# EAGLE schematic untitled (EAGLE 9.6.2)
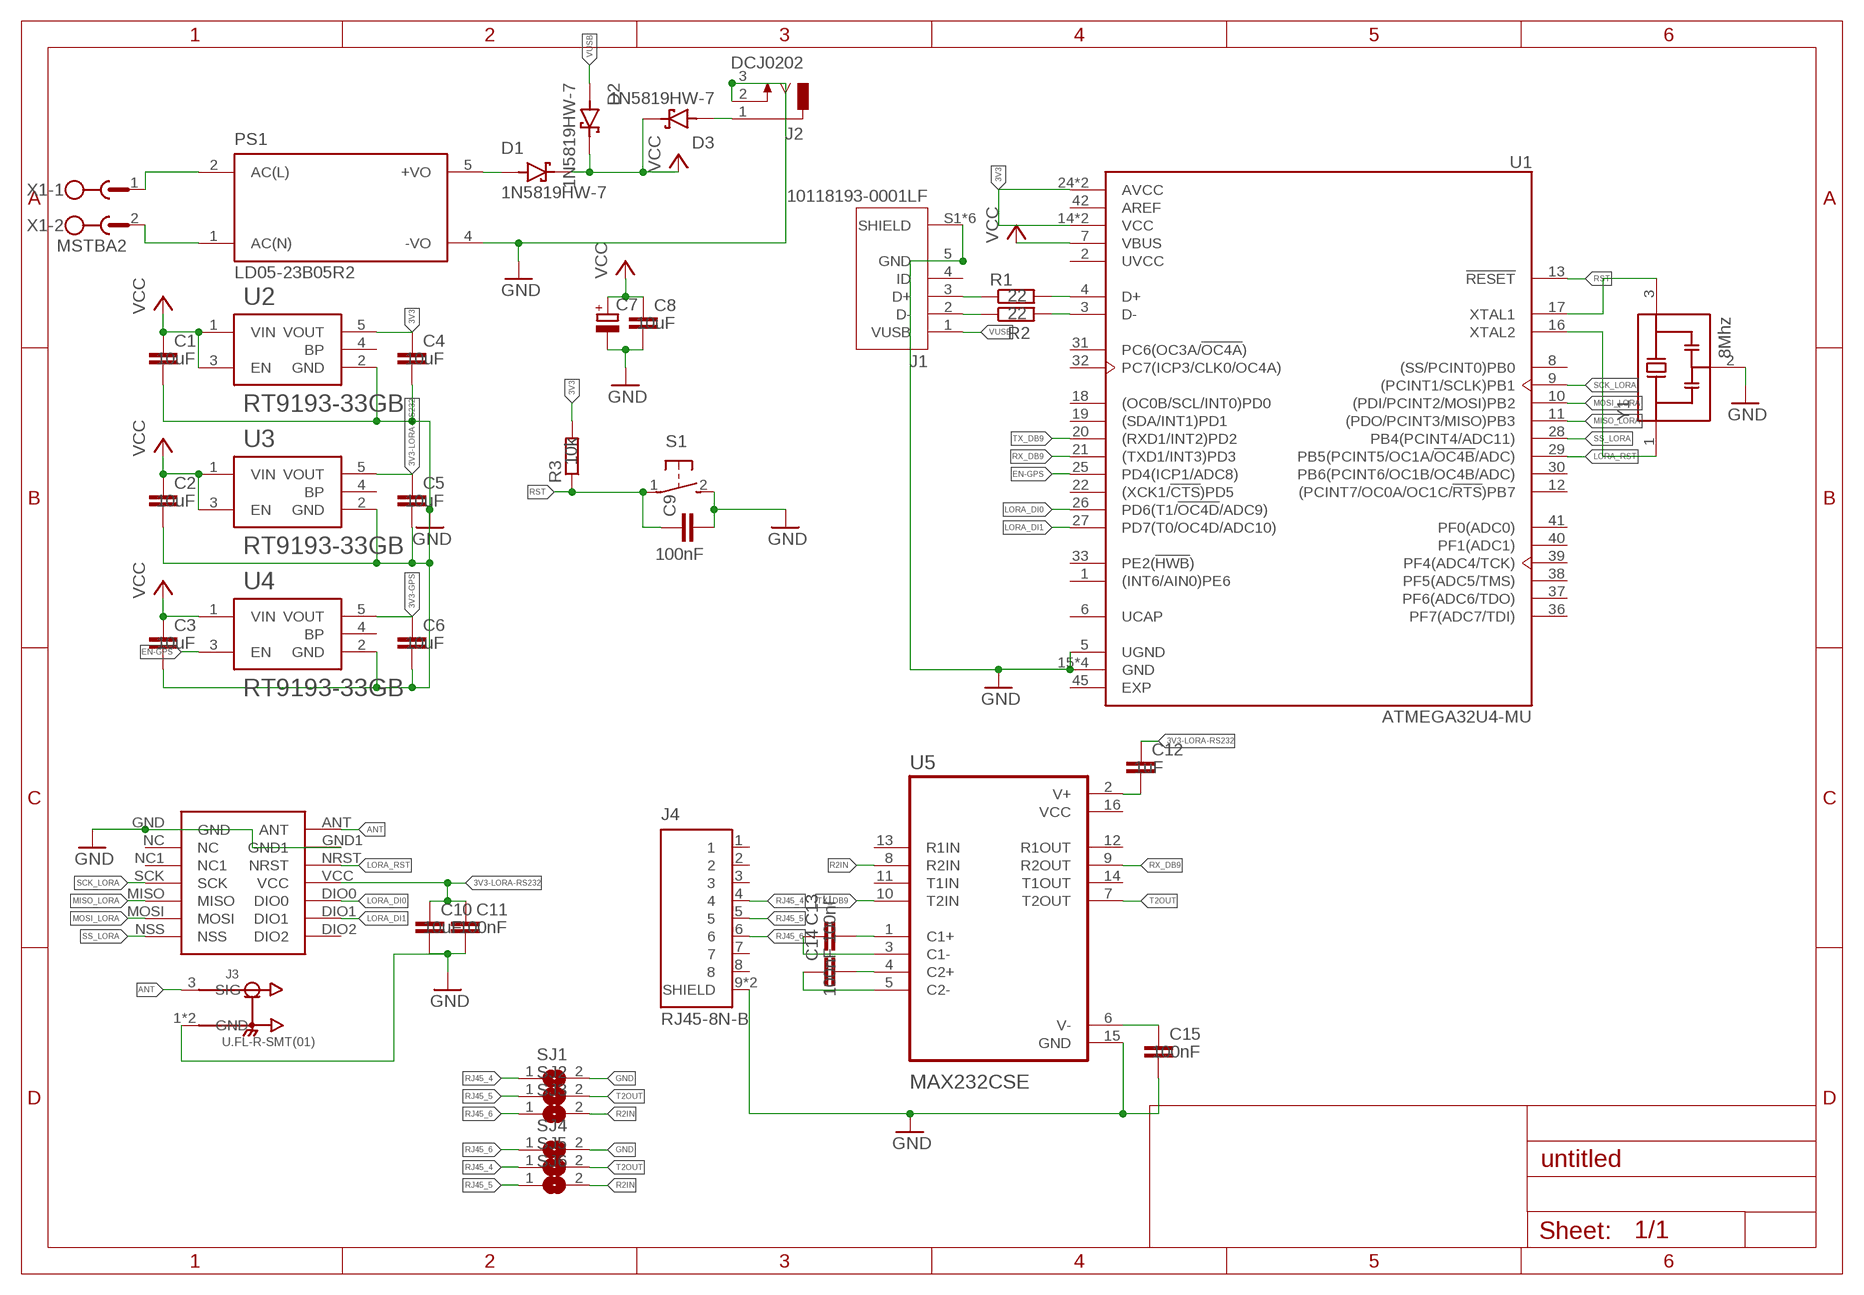
[diagram p0: schematic, sheet 1]

## Parts
C1  10uF  C-EUC0805  [C0805]
C2  10uF  C-EUC0805  [C0805]
C3  10uF  C-EUC0805  [C0805]
C4  10uF  C-EUC0805  [C0805]
C5  10uF  C-EUC0805  [C0805]
C6  10uF  C-EUC0805  [C0805]
C7  CPOL-EU153CLV-0505  [153CLV-0505]
C8  10uF  C-EUC0805  [C0805]
C9  100nF  C-EUC0805  [C0805]
C10  10uF  C-EUC0805  [C0805]
C11  100nF  C-EUC0805  [C0805]
C12  1uF  C-EUC0805  [C0805]
C13  100nF  C-EUC0805  [C0805]
C14  100nF  C-EUC0805  [C0805]
C15  100nF  C-EUC0805  [C0805]
D1  1N5819HW-7  [SOD3715X145N]
D2  1N5819HW-7  [SOD3715X145N]
D3  1N5819HW-7  [SOD3715X145N]
J1  10118193-0001LF  [FCI_10118193-0001LF]
J2  DCJ0202  [DCJ0202]
J3  U.FL-R-SMT(01)  [HRS_U.FL-R-SMT(01)]
J4  RJ45-8N-B  [TE_RJ45-8N-B]
LORA-NICERF-V1  LORA-NICERF-V2  [LORA-NICERF-V2]
PS1  LD05-23B05R2  [CONV_LD05-23B05R2]
R1  22  R-EU_R0805  [R0805]
R2  22  R-EU_R0805  [R0805]
R3  10k  R-EU_R0805  [R0805]
S1  31-XX  [B3F-31XX]
SJ1  SJ  [SJ]
SJ2  SJ  [SJ]
SJ3  SJ  [SJ]
SJ4  SJ  [SJ]
SJ5  SJ  [SJ]
SJ6  SJ  [SJ]
U1  ATMEGA32U4-MU  [QFN50P700X700X100-45N]
U2  RT9193-33GB  [SOT94P279X129-5N]
U3  RT9193-33GB  [SOT94P279X129-5N]
U4  RT9193-33GB  [SOT94P279X129-5N]
U5  MAX232CSE  [SOIC127P600X175-16N]
X1  MSTBA2  [MSTBA2]
Y1  8Mhz  CSTNE16M0V53C000R0  [OSC_CSTNE16M0V53C000R0]

## Nets
3V3: C4.1 R3.2 U1.14(VCC) U1.24(AVCC) U1.34(VCC) U1.44(AVCC) U2.5(VOUT)
3V3-GPS: C6.1 U4.5(VOUT)
3V3-LORA-RS232: C5.1 C10.1 C11.1 C12.1 LORA-NICERF-V1.VCC U3.5(VOUT)
ANT: J3.3(SIG) LORA-NICERF-V1.ANT
EN-GPS: U1.25(PD4(ICP1/ADC8)) U4.3(EN)
GND: C1.2 C2.2 C3.2 C4.2 C5.2 C6.2 C7.- C8.2 C9.2 C10.2 C11.2 C15.2 J1.5(GND) J1.S1(SHIELD) J1.S2(SHIELD) J1.S3(SHIELD) J1.S4(SHIELD) J1.S5(SHIELD) J1.S6(SHIELD) J2.2 J2.3 J3.1(GND) J3.2(GND) J4.9(SHIELD) J4.10(SHIELD) LORA-NICERF-V1.GND LORA-NICERF-V1.GND1 PS1.4(-VO) S1.2(S) SJ1.2 SJ4.2 U1.5(UGND) U1.15(GND) U1.23(GND) U1.35(GND) U1.43(GND) U2.2(GND) U3.2(GND) U4.2(GND) U5.15(GND) Y1.2(GND)
LORA_DI0: LORA-NICERF-V1.DIO0 U1.26(PD6(T1/!OC4D!/ADC9))
LORA_DI1: LORA-NICERF-V1.DIO1 U1.27(PD7(T0/OC4D/ADC10))
LORA_RST: LORA-NICERF-V1.NRST U1.29(PB5(PCINT5/OC1A/!OC4B!/ADC))
MISO_LORA: LORA-NICERF-V1.MISO U1.11((PDO/PCINT3/MISO)PB3)
MOSI_LORA: LORA-NICERF-V1.MOSI U1.10((PDI/PCINT2/MOSI)PB2)
N$1: U1.17(XTAL1) Y1.3(OUT)
N$2: U1.16(XTAL2) Y1.1(IN)
N$3: J1.3(D+) R1.1
N$4: J1.2(D-) R2.1
N$5: R1.2 U1.4(D+)
N$6: R2.2 U1.3(D-)
N$8: C15.1 U5.6(V-)
N$9: C14.2 U5.4(C2+)
N$10: C14.1 U5.5(C2-)
N$11: C13.2 U5.1(C1+)
N$12: C13.1 U5.3(C1-)
N$13: C12.2 U5.2(V+)
N$14: PS1.2(AC(L)) X1.1
N$15: PS1.1(AC(N)) X1.2
N$16: D1.A PS1.5(+VO)
N$18: D3.A J2.1
R2IN: SJ3.2 SJ6.2 U5.8(R2IN)
RJ45_4: J4.4 SJ1.1 SJ5.1
RJ45_5: J4.5 SJ2.1 SJ6.1
RJ45_6: J4.6 SJ3.1 SJ4.1
RST: C9.1 R3.1 S1.1(P) U1.13(!RESET!)
RX_DB9: U1.21((TXD1/INT3)PD3) U5.9(R2OUT)
SCK_LORA: LORA-NICERF-V1.SCK U1.9((PCINT1/SCLK)PB1)
SS_LORA: LORA-NICERF-V1.NSS U1.28(PB4(PCINT4/ADC11))
T2OUT: SJ2.2 SJ5.2 U5.7(T2OUT)
TX_DB9: U1.20((RXD1/INT2)PD2) U5.10(T2IN)
VCC: C1.1 C2.1 C3.1 C7.+ C8.1 D1.C(K) D2.C(K) D3.C(K) U1.7(VBUS) U2.1(VIN) U2.3(EN) U3.1(VIN) U3.3(EN) U4.1(VIN)
VUSB: D2.A J1.1(VUSB)
Unconnected: J1.4(ID) J4.1 J4.2 J4.3 J4.7 J4.8 LORA-NICERF-V1.DIO2 LORA-NICERF-V1.NC LORA-NICERF-V1.NC1 U1.1((INT6/AIN0)PE6) U1.6(UCAP) U1.8((SS/PCINT0)PB0) U1.12((PCINT7/OC0A/OC1C/!RTS!)PB7) U1.18((OC0B/SCL/INT0)PD0) U1.19((SDA/INT1)PD1) U1.22((XCK1/!CTS!)PD5) U1.30(PB6(PCINT6/OC1B/OC4B/ADC)) U1.31(PC6(OC3A/!OC4A!)) U1.32(PC7(ICP3/CLK0/OC4A)) U1.33(PE2(!HWB!)) U1.36(PF7(ADC7/TDI)) U1.37(PF6(ADC6/TDO)) U1.38(PF5(ADC5/TMS)) U1.39(PF4(ADC4/TCK)) U1.40(PF1(ADC1)) U1.41(PF0(ADC0)) U1.45(EXP) U2.4(BP) U3.4(BP) U4.4(BP) U5.11(T1IN) U5.12(R1OUT) U5.13(R1IN) U5.14(T1OUT)

## Power pins joined to a net without a drawn wire
AREF: U1.42(AREF)
UVCC: U1.2(UVCC)
VCC: U5.16(VCC)

## Library data of the parts
C1-C6 C8-C15 = rcl:C-EU: CAPACITOR, European symbol; SPICEPREFIX: C
C7 = rcl:CPOL-EU: POLARIZED CAPACITOR, European symbol; SPICEPREFIX: C
D1-D3 = 1N5819HW-7:1N5819HW-7: 1N5819HW Series 40 V 1 A Surface Mount Schottky Barrier Rectifier - SOD-123 Check availability <https://pricing.snapeda.com/parts/1N5819HW-7/Diodes%20Inc./view-part?ref=eda>; AVAILABILITY: In Stock; DESCRIPTION: Diode Schottky 40 V 1A Surface Mount SOD-123; MF: Diodes Inc.; MP: 1N5819HW-7; PACKAGE: SOD-123 Fairchild Semiconductor; PRICE: None; PURCHASE-URL: https://pricing.snapeda.com/search/part/1N5819HW-7/?ref=eda
J1 = 10118193-0001LF:10118193-0001LF: Micro USB B Type Receptacle Check availability <https://pricing.snapeda.com/parts/10118193-0001LF/FCI/view-part?ref=eda>; AVAILABILITY: In Stock; DESCRIPTION: USB - micro B USB 2.0 Receptacle Connector 5 Position Surface Mount, Right Angle; Through Hole; MF: FCI; MP: 10118193-0001LF; PACKAGE: None; PRICE: None; PURCHASE-URL: https://pricing.snapeda.com/search/part/10118193-0001LF/?ref=eda
J2 = con-jack:DCJ0202: DC POWER JACK Source: DCJ0202.pdf; OC_FARNELL: unknown; OC_NEWARK: unknown
J3 = U.FL-R-SMT_01_:U.FL-R-SMT(01): U.FL Series 6 Ghz 50 Ohm Ultra-small SMT Coaxial Cable Receptacle Check availability <https://pricing.snapeda.com/parts/U.FL-R-SMT%2801%29/Hirose/view-part?ref=eda>; AVAILABILITY: In Stock; DESCRIPTION: U.FL (UMCC) Connector Receptacle, Male Pin 50Ohm Surface Mount Solder. RF Connectors / Coaxial Connectors; MF: Hirose; MP: U.FL-R-SMT(01); PACKAGE: None; PRICE: None; PURCHASE-URL: https://pricing.snapeda.com/search/part/U.FL-R-SMT(01)/?ref=eda
J4 = RJ45-8N-B:RJ45-8N-B: RJ Jack / Signal Line EMI/RFI Filters 6 TERM LOW PROFILE BLOCK INDUCTOR 8 PIN Check availability <https://pricing.snapeda.com/parts/RJ45-8N-B/TE%20Connectivity/view-part?ref=eda>; AVAILABILITY: In Stock; DESCRIPTION: Jack Modular Connector 8p8c (RJ45, Ethernet) 90° Angle (Right) Unshielded -; MF: TE Connectivity; MP: RJ45-8N-B; PACKAGE: None; PRICE: None; PURCHASE-URL: https://pricing.snapeda.com/search/part/RJ45-8N-B/?ref=eda
LORA-NICERF-V1 = LORA-NICERF-V2:LORA-NICERF-V2
PS1 = LD05-23B05R2:LD05-23B05R2: AC/DC Converter Check availability <https://pricing.snapeda.com/parts/LD05-23B05R2/Mornsun%20America%2C%20LLC/view-part?ref=eda>; AVAILABILITY: In Stock; DESCRIPTION: Enclosed AC DC Converters 1 Uitgang 5V - - - 1A 85 ~ 305 VAC, 100 ~ 430 VDC Input; MF: Mornsun America, LLC; MP: LD05-23B05R2; PACKAGE: CUSTOM-4 MORNSUN; PRICE: None; PURCHASE-URL: https://pricing.snapeda.com/search/part/LD05-23B05R2/?ref=eda
R1-R3 = rcl:R-EU_: RESISTOR, European symbol; SPICEPREFIX: R
S1 = switch-omron:31-XX: OMRON SWITCH; MPN: B3F-3100; OC_FARNELL: 959704; OC_NEWARK: 36M3582
SJ1-SJ6 = jumper:SJ: SMD solder JUMPER
U1 = ATMEGA32U4-MU:ATMEGA32U4-MU: 8-bit Microcontrollers - MCU AVR USB 32K FLASH INDUSTRIA Check availability <https://pricing.snapeda.com/parts/ATMEGA32U4-MU/Microchip/view-part?ref=eda>; AVAILABILITY: In Stock; DESCRIPTION: IC, 8-BIT MCU, ASSP AVR, 16MHZ, 44-VQFN; Controller Family/Series:AVR MEGA; Core Size:8bit; No. of I/O's:26; Supply Voltage Range:2.7V to 5.5V; Digital IC Case Style:VQFN; No. of Pins:44; Program Memory Size:32 KB ;RoHS Compliant: Yes; MF: Microchip; MP: ATMEGA32U4-MU; PACKAGE: VQFN-44 Atmel; PRICE: None; PURCHASE-URL: https://pricing.snapeda.com/search/part/ATMEGA32U4-MU/?ref=eda
U2-U4 = RT9193-33GB:RT9193-33GB: RT9193 Series 300 mA 3.3 V Ultra-Low Noise Ultra-Fast CMOS LDO Regulator-SC-70-5 Check availability <https://pricing.snapeda.com/parts/RT9193-33GB/Richtek%20USA%20Inc./view-part?ref=eda>; AVAILABILITY: In Stock; DESCRIPTION: Linear Voltage Regulator IC Positive Fixed 1 Output 300mA SOT-23-5; MF: Richtek USA Inc.; MP: RT9193-33GB; PACKAGE: SOT-23-5 Richtek; PRICE: None; PURCHASE-URL: https://pricing.snapeda.com/search/part/RT9193-33GB/?ref=eda
U5 = MAX232CSE:MAX232CSE: Check availability <https://pricing.snapeda.com/parts/MAX232CSE/Maxim%20Integrated/view-part?ref=eda>; AVAILABILITY: In Stock; DESCRIPTION: 2/2 Transceiver Full RS232 16-SOIC; MF: Maxim Integrated; MP: MAX232CSE; PACKAGE: SOIC-16 Maxim Integrated; PRICE: None; PURCHASE-URL: https://pricing.snapeda.com/search/part/MAX232CSE/?ref=eda
X1 = con-phoenix-508:MSTBA2: PHOENIX; MF: FARNELL; MPN: 1757242; OC_FARNELL: 3705171; OC_NEWARK: 71C4161
Y1 = CSTNE16M0V53C000R0:CSTNE16M0V53C000R0: 16MHz Ceramic Resonator Built in Capacitor 15pF ±0.15% 40 Ohms -40°C ~ 125°C Surface Mount Check availability <https://pricing.snapeda.com/parts/CSTNE16M0V53C000R0/Murata/view-part?ref=eda>; AVAILABILITY: In Stock; DESCRIPTION: 16 MHz Ceramic Resonator Built in Capacitor 15 pF ±0.15% 40 Ohms -40°C ~ 125°C Surface Mount; MF: Murata; MP: CSTNE16M0V53C000R0; PACKAGE: SMD-3 Murata; PRICE: None; PURCHASE-URL: https://pricing.snapeda.com/search/part/CSTNE16M0V53C000R0/?ref=eda